# EAGLE schematic sensor_board_repair (EAGLE 9.0.0)
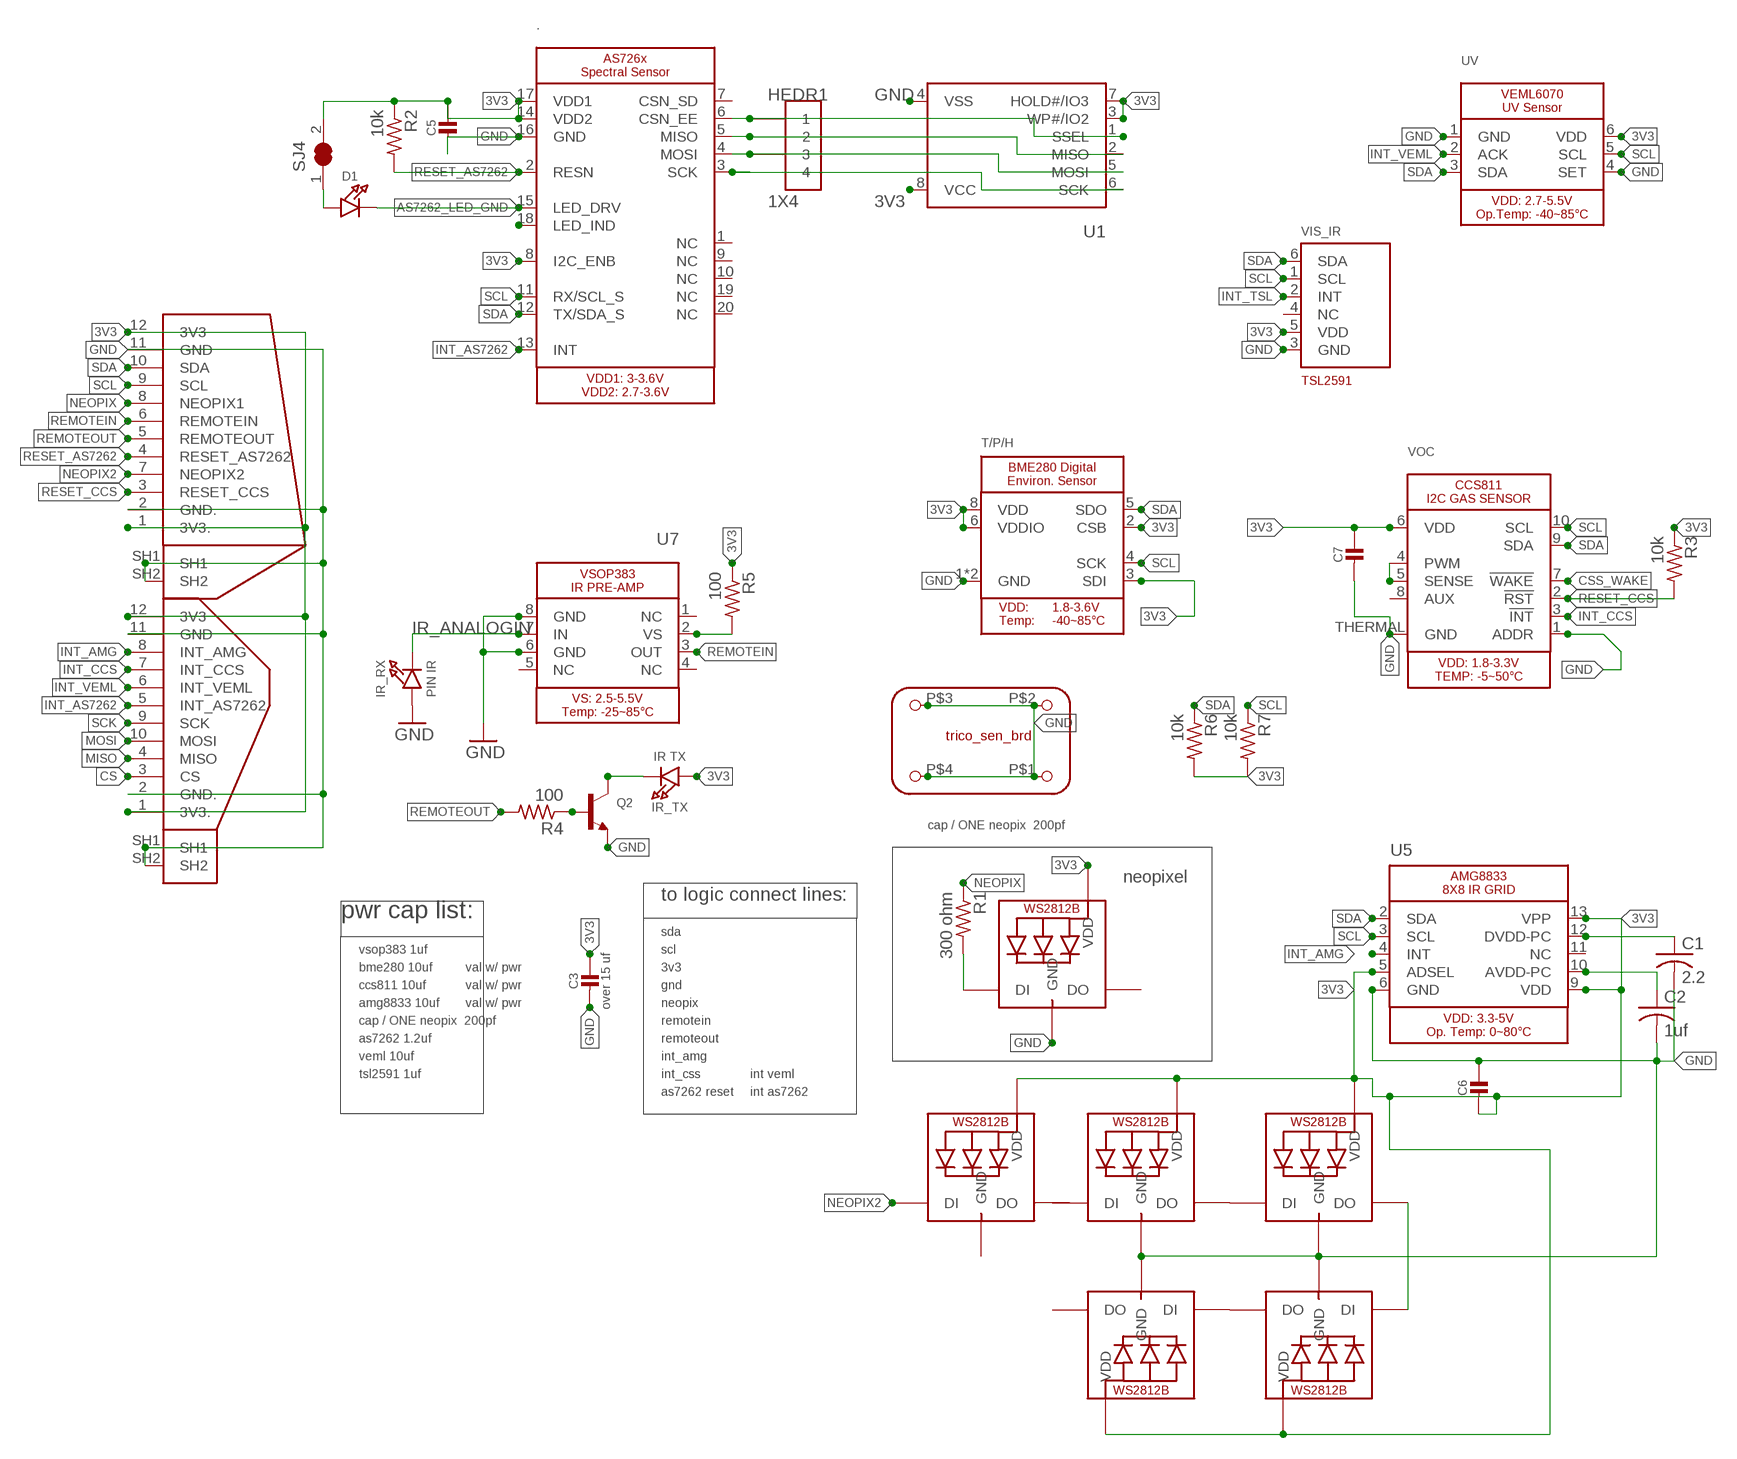
[diagram p0: schematic, sheet 1]

## Parts
.  SEN-SPECTRAL-AS726X-NEEDS_MEMORYEXTEN  [MICROBUILDER_AS726X_LGA20_EXTENDED]
..  WS2812B_5050N  [WS2812B-NARROW]
...  WS2812B_5050N  [WS2812B-NARROW]
....  WS2812B_5050N  [WS2812B-NARROW]
.....  WS2812B_5050N  [WS2812B-NARROW]
......  WS2812B_5050N  [WS2812B-NARROW]
C1  2.2  C-USC0805  [C0805]
C2  1uf  C-USC0805  [C0805]
C3  over 15 uf  C-US__0805  [MICROBUILDER__0805]
C5  C-US_0805-NOTHERMALS  [MICROBUILDER_0805_NOTHERMALS]
C6  C-US_0805-NOTHERMALS  [MICROBUILDER_0805_NOTHERMALS]
C7  C-US_0805-NOTHERMALS  [MICROBUILDER_0805_NOTHERMALS]
D1  LED-MICROBUILDER1206  [MICROBUILDER_CHIPLED_1206]
HEDR1  1X4  [1X4_POGO]
IR_RX  PIN IR  LED1206  [CHIPLED_1206]
IR_TX  IR TX  LED1206  [CHIPLED_1206]
LED1  LED-NEO-WS2812B5050  [WS2812B]
Q2  TRANSISTOR_NPNWIDE  [SOT23-WIDE]
R1  300 ohm  R-US_R0805  [R0805]
R2  10k  R-US_R0805  [R0805]
R3  10k  R-US_R0805  [R0805]
R4  100  R-US_R0805  [R0805]
R5  100  R-US_R0805  [R0805]
R6  10k  R-US_R0805  [R0805]
R7  10k  R-US_R0805  [R0805]
SJ4  JUMPER_CLOSEDTEMP  [SOLDERJUMPER_CLOSEDWIRE]
T/P/H  SEN-ENVIRO-BME280EXTEN_TG  [MICROBUILDER_BME280-EXTENDED]
U1  FLASH-SPI-FOR_ADA_AS7262  [MICROBUILDER_09_NOV_2015_SOIC8_150MIL]
U5  SEN-AMG8833-8X8THERMAL-ADAEXTEN  [MICROBUILDER_AMG8833_EXTENDED]
U7  IR-INTRFC-VSOP383EXTEN  [VSOP383_EXTENDED]
U$1  SEN_BRD_TRICO04C  [TRICO04C_SEN_BRD]
U$4  HEDR-SEN-I2CSLAVE_EXTEN  [FPC_TE_1-1734839-2_EXTENDED]
U$5  HEDR-SEN-INTSLAVE_EXTEN  [FPC_TE_1-1734839-2_EXTENDED]
UV  SEN-UV-I2C-VEML6070EXTEN  [MICROBUILDER_VEML6070_EXTENDED]
VIS_IR  SEN-LIGHT_LUX-HDR-TSL2591EXTEB  [MICROBUILDER_DFN6_TAOS_EXTENDED]
VOC  SEN-GAS-CCS811-PARTS/MILLIONEXTEN  [MICROBUILDER_CCS811-EXTENDED]

## Nets
3V3: ..8(I2C_ENB) ..14(VDD2) ..17(VDD1) ...1-VDD(VDD) ....1-VDD(VDD) .....1-VDD(VDD) ......1-VDD(VDD) .......1-VDD(VDD) C3.1 C5.1 C6.2 C7.1 IR_TX.A LED1.1-VDD(VDD) R2.1 R3.1 R5.1 R6.2 R7.2 SJ4.2 T/P/H.2(CSB) T/P/H.3(SDI) T/P/H.6(VDDIO) T/P/H.8(VDD) U1.3(WP#/IO2) U1.7(HOLD#/IO3) U1.8(VCC) U5.5(ADSEL) U5.9(VDD) U5.13(VPP) U$4.1(3V3.) U$4.12(3V3) U$5.1(3V3.) U$5.12(3V3) UV.6(VDD) VIS_IR.5(VDD) VOC.6(VDD)
AMGCAPAV: C1.1 C2.1 U5.10(AVDD-PC) U5.12(DVDD-PC)
AS7262_LED_GND: ..15(LED_DRV) D1.C
CS: U$5.3(CS)
CSS_WAKE: VOC.7(!WAKE)
FLASH_CS: ..6(CSN_EE) HEDR1.1 U1.1(SSEL)
FLASH_MISO: ..5(MISO) HEDR1.2 U1.2(MISO)
FLASH_MOSI: ..4(MOSI) HEDR1.3 U1.5(MOSI)
FLASH_SCK: ..3(SCK) HEDR1.4 U1.6(SCK)
GND: ..16(GND) ....3-GND(GND) .....3-GND(GND) ......3-GND(GND) .......3-GND(GND) C1.2 C2.2 C3.2 C5.2 C6.1 C7.2 IR_RX.A LED1.3-GND(GND) Q2.2(E) T/P/H.1(GND) T/P/H.7(GND) U1.4(VSS) U5.6(GND) U7.6(GND) U7.8(GND) U$1.P$1 U$1.P$2 U$1.P$3 U$1.P$4 U$4.2(GND.) U$4.11(GND) U$4.SH1 U$4.SH2 U$5.2(GND.) U$5.11(GND) U$5.SH1 U$5.SH2 UV.1(GND) UV.4(SET) VIS_IR.3(GND) VOC.1(ADDR) VOC.THERMAL(GND)
INT_AMG: U5.4(INT) U$5.8(INT_AMG)
INT_AS7262: ..13(INT) U$5.5(INT_AS7262)
INT_CCS: U$5.7(INT_CCS) VOC.3(!INT)
INT_TSL: VIS_IR.2(INT)
INT_VEML: U$5.6(INT_VEML) UV.2(ACK)
IR_ANALOGIN: IR_RX.C U7.7(IN)
MISO: U$5.4(MISO)
MOSI: U$5.10(MOSI)
N$1: VOC.4(PWM) VOC.5(SENSE)
N$2: D1.A SJ4.1
N$3: R5.2 U7.2(VS)
N$4: Q2.1(B) R4.1
N$5: ....2-DOUT(DO) .....4-DIN(DI)
N$8: ......2-DOUT(DO) .......4-DIN(DI)
N$11: .....2-DOUT(DO) ......4-DIN(DI)
N$13: LED1.4-DIN(DI) R1.2
N$21: IR_TX.C Q2.3(C)
N$22: ..18(LED_IND)
NEOPIX: R1.1 U$4.8(NEOPIX1)
NEOPIX2: ...4-DIN(DI) U$4.7(NEOPIX2)
REMOTEIN: U7.3(OUT) U$4.6(REMOTEIN)
REMOTEOUT: R4.2 U$4.5(REMOTEOUT)
RESET_AS7262: ..2(RESN) R2.2 U$4.4(RESET_AS7262)
RESET_CCS: R3.2 U$4.3(RESET_CCS) VOC.2(!RST)
SCK: U$5.9(SCK)
SCL: ..11(RX/SCL_S) R7.1 T/P/H.4(SCK) U5.3(SCL) U$4.9(SCL) UV.5(SCL) VIS_IR.1(SCL) VOC.10(SCL)
SDA: ..12(TX/SDA_S) R6.1 T/P/H.5(SDO) U5.2(SDA) U$4.10(SDA) UV.3(SDA) VIS_IR.6(SDA) VOC.9(SDA)
Unconnected: ..1(NC) ..7(CSN_SD) ..9(NC) ..10(NC) ..19(NC) ..20(NC) ...2-DOUT(DO) ....4-DIN(DI) .......2-DOUT(DO) LED1.2-DOUT(DO) U5.11(NC) U7.1(NC) U7.4(NC) U7.5(NC) VIS_IR.4(NC) VOC.8(AUX)

## Notes on the sheet
- cap / ONE neopix  200pf
- neopixel
- to logic connect lines:
- pwr cap list:
- sda
- vsop383 1uf | scl
- bme280 10uf | val w/ pwr | 3v3
- ccs811 10uf | val w/ pwr | gnd
- amg8833 10uf | val w/ pwr | neopix
- cap / ONE neopix  200pf | remotein
- as7262 1.2uf | remoteout
- veml 10uf | int_amg
- tsl2591 1uf | int_css | int veml
- as7262 reset | int as7262

## Power pins joined to a net without a drawn wire
GND: ...3-GND(GND)

## Library data of the parts
. = 0TG-Lib v01.1:SEN-SPECTRAL-AS726X-NEEDS_MEMORY: from: microbuilder AS726x Spectral Sensor
.. ... .... ..... ...... = 00adafruit:WS2812B
C1 C2 = 0TG-Lib v01.0:C-US: CAPACITOR, American symbol from: eaglecad RCL
C3 = 0TG-Lib v01.1:C-US_: from: microbuilder Ceramic Capacitors For new designs, use the packages preceded by an '_' character since they are more reliable: The following footprints should be used on most boards: _0402 - Standard footprint for regular board layouts _0603 - Standard footprint for regular board layouts _0805 - Standard footprint for regular board layouts _1206 - Standard footprint for regular board layouts For extremely tight-pitch boards where space is at a premium, the following 'micro-pitch' footprints can be used (smaller pads, no silkscreen outline, etc.): _0402MP - Micro-pitch footprint for very dense/compact boards _0603MP - Micro-pitch footprint for very dense/compact boards _0805MP - Micro-pitch footprint for very dense/compact boards _1206MP - Micro-pitch footprint for very dense/compact boards
C5-C7 = 0TG-Lib v01.2:C-US_: from: microbuilder Ceramic Capacitors For new designs, use the packages preceded by an '_' character since they are more reliable: The following footprints should be used on most boards: _0402 - Standard footprint for regular board layouts _0603 - Standard footprint for regular board layouts _0805 - Standard footprint for regular board layouts _1206 - Standard footprint for regular board layouts For extremely tight-pitch boards where space is at a premium, the following 'micro-pitch' footprints can be used (smaller pads, no silkscreen outline, etc.): _0402MP - Micro-pitch footprint for very dense/compact boards _0603MP - Micro-pitch footprint for very dense/compact boards _0805MP - Micro-pitch footprint for very dense/compact boards _1206MP - Micro-pitch footprint for very dense/compact boards
D1 = 0TG-Lib v01.1:LED-MICROBUILDER: from: microbuilder LED 0603 - 0603 Surface Mount Package 2mA: Green LED - Low Power (3.9mcd, 2ma, 1.7Vf) - Digikey: 475-2709-2-ND Orange LED - Low Power (9.8mcd, 2ma, 1.8Vf) - Digikey: 475-1194-2-ND Red LED - Low Power (5mcd, 2ma, 1.8Vf) - Digikey: 475-1195-2-ND Yellow LED - Low Power (7mcd, 2ma, 1.8Vf) - Digikey: 475-1196-2-ND 5mA: Blue LED - Low Power (17mcd, 5ma, 2.9Vf) - Digikey: LNJ937W8CRACT-ND 0805 - 0805 Surface Mount Package 2mA: Red LED (8.8mcd, 2mA, 1.8Vf, Clear) - Low Power [Digikey: 475-2510-1-ND] Green LED (5mcd, 2mA, 1.8Vf, Clear) - Low Power [Digikey: 475-2730-1-ND] Yellow LED (11.3mcd, 2mA, 1.8Vf, Clear) - Low Power [Digikey: 475-2555-1-ND] 20mA: Red LED (104mcd, 20mA, Diffused) - LS R976 [Digikey: 475-1278-6-ND] Red LED (12mcd, 20mA, 2.0Vf, Clear) - APT2012EC [Digikey: 754-1128-1-ND] Green LED (15mcd, 20mA, 2.2Vf, Clear) - APT2012GC [Digikey: 754-1131-1-ND] Orange LED (160mcd, 20mA, 2.1Vf, Clear) - APT2012SECK [Digikey: 754-1130-1-ND] 1206 - 1206 Surface Mount Package Green LED (26mcd, 20mA, Diffused) - LG N971 [Digikey: 475-1407-6-ND] Red LED (15mcd, 20mA, Diffused) - LH N974 [Digikey: 475-1416-6-ND] Cree - Cree High-Power Surface Mount LEDs XPEBWT-L1-0000-00D50 - White 111lm 350mA 2.9Vf 6200K 110° XTEAWT-00-0000-00000LEE3 - White 114lm 350mA 2.85Vf 5000K 115° Everlight - Everlight 45-21 Series Surface Mount LEDs 45-21/QK2C-B2832AC2CB2/2T - Warm White 2000mcd 20mA 3.25Vf 3050K 120° 45-21/LK2C-B38452C4CB2/2T - Nuetral White 2000mcd 20mA 3.25Vf 4150K 120° 45-21/LK2C-B50634C6CB2/2T - Cold White 2200mcd 20mA 3.25Vf 5650K 120° PLCC2 Reverse Mount LS T77K-J1L2-1-0-2-R18-Z - Red 11.25mcd 2mA 1.8Vf 630nm 120° LO T77K-L1M2-24-Z - Orange 19.6mcd 2mA 1.8Vf 606nm 120° LY T77K-K2M1-26-Z - Yellow 15.7mcd 2mA 1.8Vf 587nm 120°
HEDR1 = 0TG-Lib v01.1:1X4
IR_RX IR_TX = microbuilder:LED: LED 0603 - 0603 Surface Mount Package 2mA: Green LED - Low Power (3.9mcd, 2ma, 1.7Vf) - Digikey: 475-2709-2-ND Orange LED - Low Power (9.8mcd, 2ma, 1.8Vf) - Digikey: 475-1194-2-ND Red LED - Low Power (5mcd, 2ma, 1.8Vf) - Digikey: 475-1195-2-ND Yellow LED - Low Power (7mcd, 2ma, 1.8Vf) - Digikey: 475-1196-2-ND 5mA: Blue LED - Low Power (17mcd, 5ma, 2.9Vf) - Digikey: LNJ937W8CRACT-ND 0805 - 0805 Surface Mount Package 2mA: Red LED (8.8mcd, 2mA, 1.8Vf, Clear) - Low Power [Digikey: 475-2510-1-ND] Green LED (5mcd, 2mA, 1.8Vf, Clear) - Low Power [Digikey: 475-2730-1-ND] Yellow LED (11.3mcd, 2mA, 1.8Vf, Clear) - Low Power [Digikey: 475-2555-1-ND] 20mA: Red LED (104mcd, 20mA, Diffused) - LS R976 [Digikey: 475-1278-6-ND] Red LED (12mcd, 20mA, 2.0Vf, Clear) - APT2012EC [Digikey: 754-1128-1-ND] Green LED (15mcd, 20mA, 2.2Vf, Clear) - APT2012GC [Digikey: 754-1131-1-ND] Orange LED (160mcd, 20mA, 2.1Vf, Clear) - APT2012SECK [Digikey: 754-1130-1-ND] 1206 - 1206 Surface Mount Package Green LED (26mcd, 20mA, Diffused) - LG N971 [Digikey: 475-1407-6-ND] Red LED (15mcd, 20mA, Diffused) - LH N974 [Digikey: 475-1416-6-ND] Cree - Cree High-Power Surface Mount LEDs XPEBWT-L1-0000-00D50 - White 111lm 350mA 2.9Vf 6200K 110° XTEAWT-00-0000-00000LEE3 - White 114lm 350mA 2.85Vf 5000K 115° Everlight - Everlight 45-21 Series Surface Mount LEDs 45-21/QK2C-B2832AC2CB2/2T - Warm White 2000mcd 20mA 3.25Vf 3050K 120° 45-21/LK2C-B38452C4CB2/2T - Nuetral White 2000mcd 20mA 3.25Vf 4150K 120° 45-21/LK2C-B50634C6CB2/2T - Cold White 2200mcd 20mA 3.25Vf 5650K 120° PLCC2 Reverse Mount LS T77K-J1L2-1-0-2-R18-Z - Red 11.25mcd 2mA 1.8Vf 630nm 120° LO T77K-L1M2-24-Z - Orange 19.6mcd 2mA 1.8Vf 606nm 120° LY T77K-K2M1-26-Z - Yellow 15.7mcd 2mA 1.8Vf 587nm 120°
LED1 = 0TG-Lib v01.0:LED-NEO-WS2812B: from: adafruit
Q2 = 0TG-Lib v01.1:TRANSISTOR_NPN: NPN Transistor Transistor (NPN) 500mA 45V - BC817 [Digikey: 568-1631-1-ND] Transistor (NPN) 500mA 45V - BC817,215 [Mouser: 771-BC817-T/R] SOT23-R - SOT23 footprint optimised for use with solder paste and reflow ovens. SOT23-W - SOT23 footprint optimised for hand-soldering (larger pads). from: microbuilder
R1-R7 = 0TG-Lib v01.1:R-US_: from: eaglecad RESISTOR, American symbol; SPICEPREFIX: R
SJ4 = 0TG-Lib v01.1:JUMPER_CLOSED: Solder Jumper - Closed from: microbuilder These solder jumpers are closed by default CLOSEDWIRE - 10 mil trace between pads that can be cut and resoldered later CLOSEDPERM - 63 mil trace between pads for a permanent connection (used to 'bridge' two signals, a shameless hack for Eagle). Can double as a test point as well (no cream layer)
T/P/H = 0TG-Lib v01.1:SEN-ENVIRO-BME280: from: microbuilder BME280 - Environmental Sensor (I2C + SPI)
U1 = 0TG-Lib v01.1:FLASH-SPI-FOR_ADA_AS7262: from: microbuilder SOIC8 SPI Flash Be careful with the size since SOIC8 flash comes in several 'widths' SOIC8 150 mil M25P16 - 16Mbit (2Mbit x 8) Serial Flash (75MHz SPI Bus), Supply: 2.7-3.6V Digikey: SOIC8 - M25P16-VMN6P-ND SOIC8 208 mil W25Q16BVSSIG - 16Mbit (2Mbit x 8) Serial Flash (104MHz SPI Bus), Supply: 2.7-3.6V Digikey: SOIC8 - W25Q16BVSSIG-ND
U5 = 0TG-Lib v01.1:SEN-AMG8833-8X8THERMAL-ADA: AMG8833 8x8 IR Grid Sensor Viewing Angle: ~60° Temp Accuracy: +/-2-3°C (high/low gain) from: adafruit
U7 = 0TG-Lib v01.1:IR-INTRFC-VSOP383: from: adafruit VSOP383 - Preamplifier Circuit for IR Remote Control
U$1 = 0Trico04_lib:SEN_BRD_TRICO04C
U$4 = 0Trico04_lib:HEDR-SEN-I2C
U$5 = 0Trico04_lib:HEDR-SEN-INT
UV = 0TG-Lib v01.1:SEN-UV-I2C-VEML6070: from: microbuilder VEML6070 - UV Light Sensor Supply: 2.7-5.5V Peak Sensitivity: 355nm Spectral Range: 320-410nm
VIS_IR = 0TG-Lib v01.1:SEN-LIGHT_LUX-HDR-TSL2591: from: microbuilder TSL2591 Light-To-Digital Sensor
VOC = 0TG-Lib v01.1:SEN-GAS-CCS811-PARTS/MILLION: from: microbuilder CCS811 - I2C Gas and Air Quality Sensor